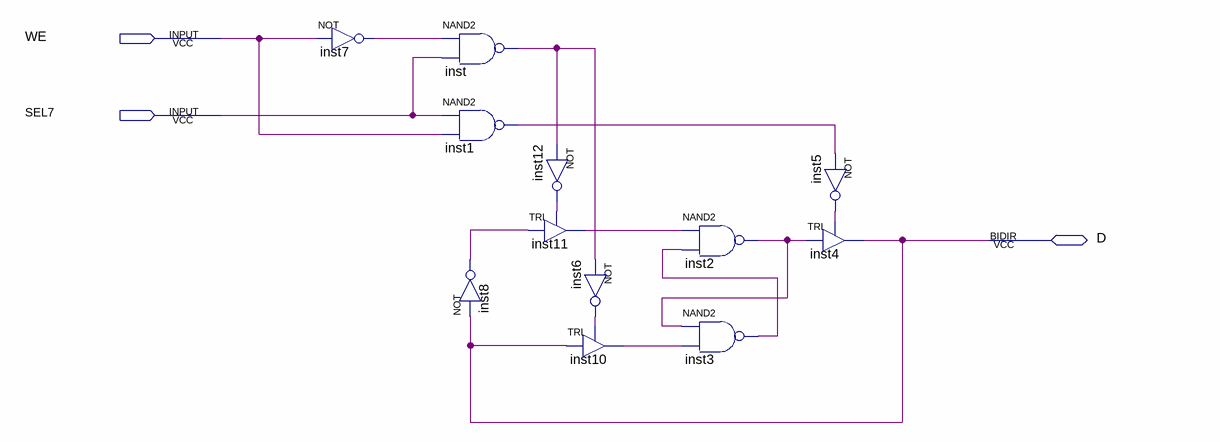
[diagram p0: schematic sheet]
// Quartus schematic ci_74189a.bdf as structural Verilog: 12 symbols, 3 pins
module ci_74189a (
  input  WE,
  input  SEL7,
  inout  D
);

  wire inst1_out, inst2_out, inst3_out, inst5_out, inst6_out, inst7_out, inst8_out, inst10_out, inst11_out,
       inst12_out, inst_out;

  not inst7 (inst7_out, WE);
  nand inst (inst_out, inst7_out, SEL7);
  nand inst1 (inst1_out, SEL7, WE);
  not inst8 (inst8_out, D);
  not inst12 (inst12_out, inst_out);
  TRI inst11 (.IN(inst8_out), .OE(inst12_out), .OUT(inst11_out));
  not inst6 (inst6_out, inst_out);
  TRI inst10 (.IN(D), .OE(inst6_out), .OUT(inst10_out));
  nand inst2 (inst2_out, inst11_out, inst3_out);
  nand inst3 (inst3_out, inst2_out, inst10_out);
  not inst5 (inst5_out, inst1_out);
  TRI inst4 (.IN(inst2_out), .OE(inst5_out), .OUT(D));
endmodule
